# Altium project Core.PrjPcb
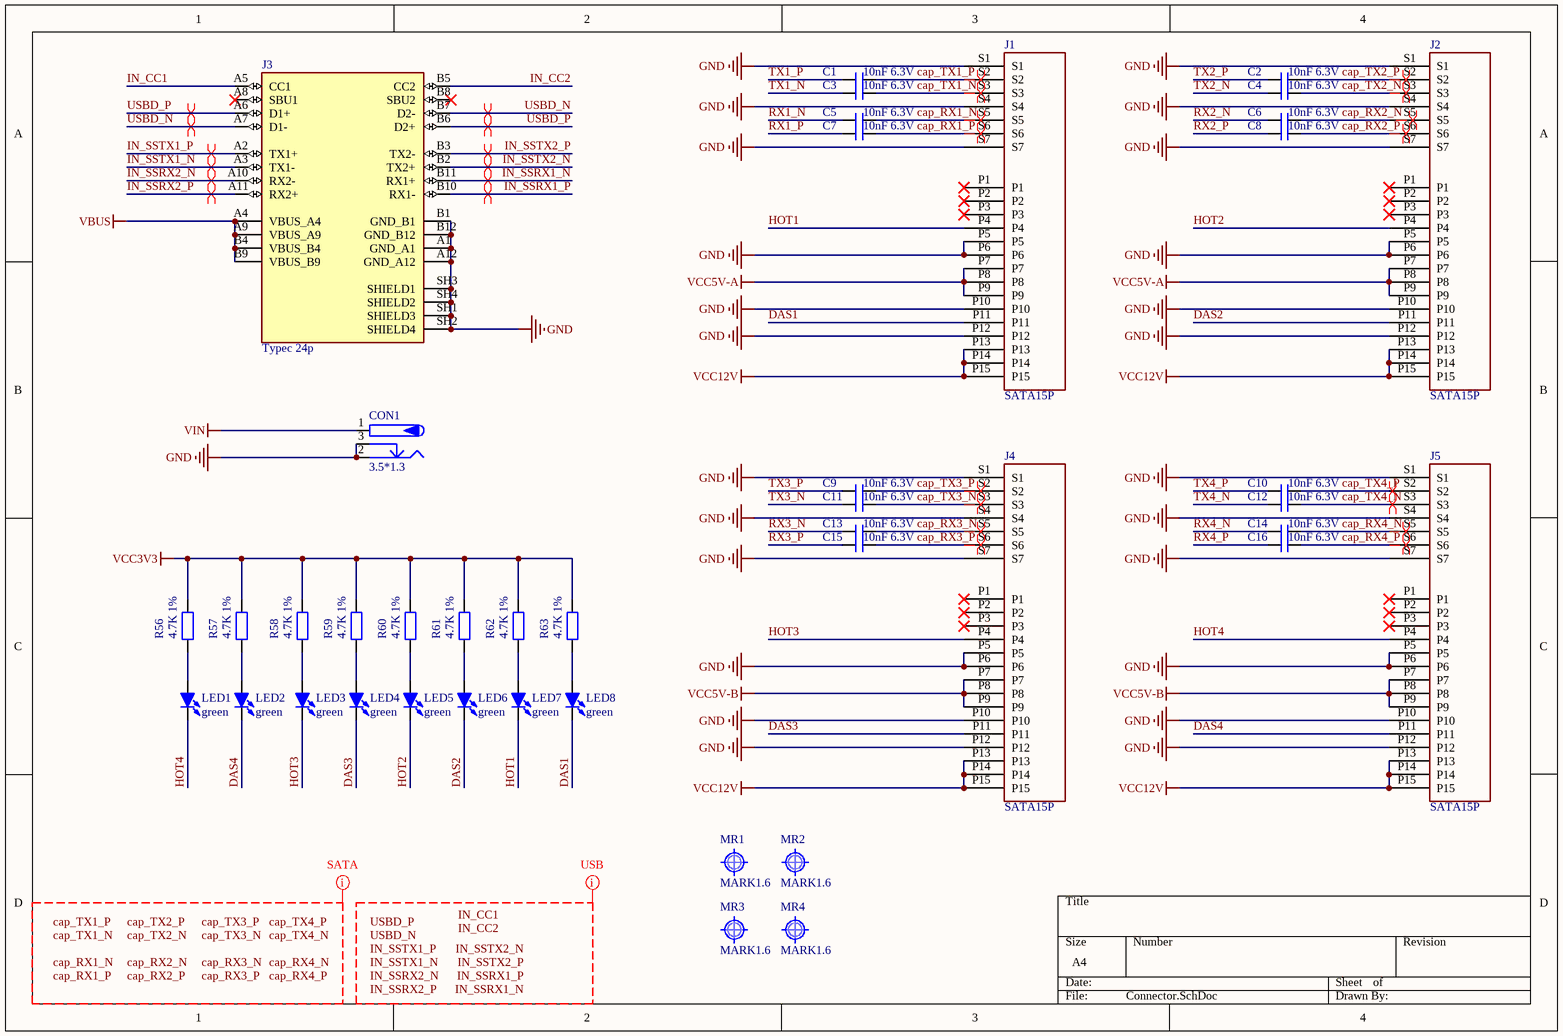
[diagram p0: Connector.SchDoc]
4 sheets, 290 parts. Net scope: global (net labels, ports and power ports of the same name join across sheets).
Board files: PCB1.PcbDoc, Core.PcbDoc
Sheets:
  Connector.SchDoc
  jms578.SchDoc
  Pwr.SchDoc
  Vl822.SchDoc

## Sheet Connector.SchDoc
size A4; SheetNumber: 1; SheetTotal: 4

### Parts
C1  10nF 6.3V  [C0402_L]
C2  10nF 6.3V  [C0402_L]
C3  10nF 6.3V  [C0402_L]
C4  10nF 6.3V  [C0402_L]
C5  10nF 6.3V  [C0402_L]
C6  10nF 6.3V  [C0402_L]
C7  10nF 6.3V  [C0402_L]
C8  10nF 6.3V  [C0402_L]
C9  10nF 6.3V  [C0402_L]
C10  10nF 6.3V  [C0402_L]
C11  10nF 6.3V  [C0402_L]
C12  10nF 6.3V  [C0402_L]
C13  10nF 6.3V  [C0402_L]
C14  10nF 6.3V  [C0402_L]
C15  10nF 6.3V  [C0402_L]
C16  10nF 6.3V  [C0402_L]
CON1  3.5*1.3  [DC-012]
J1  SATA15P  [SATA 15P 贴片]
J2  SATA15P  [SATA 15P 贴片]
J3  Typec 24p  [TypeC 24p 直立]
J4  SATA15P  [SATA 15P 贴片]
J5  SATA15P  [SATA 15P 贴片]
LED1  green  [LED 0805G]
LED2  green  [LED0805_W]
LED3  green  [LED 0805G]
LED4  green  [LED0805_W]
LED5  green  [LED 0805G]
LED6  green  [LED0805_W]
LED7  green  [LED 0805G]
LED8  green  [LED0805_W]
MR1  MARK1.6  [Mark 1]
MR2  MARK1.6  [Mark 1]
MR3  MARK1.6  [Mark 1]
MR4  MARK1.6  [Mark 1]
R56  4.7K 1%  [R0402_L]
R57  4.7K 1%  [R0402_L]
R58  4.7K 1%  [R0402_L]
R59  4.7K 1%  [R0402_L]
R60  4.7K 1%  [R0402_L]
R61  4.7K 1%  [R0402_L]
R62  4.7K 1%  [R0402_L]
R63  4.7K 1%  [R0402_L]

### Nets
GND: CON1.2 CON1.3 J1.P5 J1.P6 J1.P10 J1.P12 J1.S1 J1.S4 J1.S7 J2.P5 J2.P6 J2.P10 J2.P12 J2.S1 J2.S4 J2.S7 J3.A1(GND_A1) J3.A12(GND_A12) J3.B1(GND_B1) J3.B12(GND_B12) J3.SH1(SHIELD3) J3.SH2(SHIELD4) J3.SH3(SHIELD1) J3.SH4(SHIELD2) J4.P5 J4.P6 J4.P10 J4.P12 J4.S1 J4.S4 J4.S7 J5.P5 J5.P6 J5.P10 J5.P12 J5.S1 J5.S4 J5.S7
VBUS: J3.A4(VBUS_A4) J3.A9(VBUS_A9) J3.B4(VBUS_B4) J3.B9(VBUS_B9)
VCC3V3: R56.1 R57.1 R58.1 R59.1 R60.1 R61.1 R62.1 R63.1
VCC5V-A: J1.P7 J1.P8 J1.P9 J2.P7 J2.P8 J2.P9
VCC5V-B: J4.P7 J4.P8 J4.P9 J5.P7 J5.P8 J5.P9
VCC12V: J1.P13 J1.P14 J1.P15 J2.P13 J2.P14 J2.P15 J4.P13 J4.P14 J4.P15 J5.P13 J5.P14 J5.P15
VIN: CON1.1
cap_RX1_N: C5.1 J1.S5
cap_RX1_P: C7.1 J1.S6
cap_RX2_N: C6.1 J2.S5
cap_RX2_P: C8.1 J2.S6
cap_RX3_N: C13.1 J4.S5
cap_RX3_P: C15.1 J4.S6
cap_RX4_N: C14.1 J5.S5
cap_RX4_P: C16.1 J5.S6
cap_TX1_N: C3.1 J1.S3
cap_TX1_P: C1.1 J1.S2
cap_TX2_N: C4.1 J2.S3
cap_TX2_P: C2.1 J2.S2
cap_TX3_N: C11.1 J4.S3
cap_TX3_P: C9.1 J4.S2
cap_TX4_N: C12.1 J5.S3
cap_TX4_P: C10.1 J5.S2
DAS1: J1.P11 LED8.2(K)
DAS2: J2.P11 LED6.2(K)
DAS3: J4.P11 LED4.2(K)
DAS4: J5.P11 LED2.2(K)
HOT1: J1.P4 LED7.2(K)
HOT2: J2.P4 LED5.2(K)
HOT3: J4.P4 LED3.2(K)
HOT4: J5.P4 LED1.2(K)
IN_CC1: J3.A5(CC1)
IN_CC2: J3.B5(CC2)
IN_SSRX1_N: J3.B11(RX1+)
IN_SSRX1_P: J3.B10(RX1-)
IN_SSRX2_N: J3.A10(RX2-)
IN_SSRX2_P: J3.A11(RX2+)
IN_SSTX1_N: J3.A3(TX1-)
IN_SSTX1_P: J3.A2(TX1+)
IN_SSTX2_N: J3.B2(TX2+)
IN_SSTX2_P: J3.B3(TX2-)
RX1_N: C5.2
RX1_P: C7.2
RX2_N: C6.2
RX2_P: C8.2
RX3_N: C13.2
RX3_P: C15.2
RX4_N: C14.2
RX4_P: C16.2
TX1_N: C3.2
TX1_P: C1.2
TX2_N: C4.2
TX2_P: C2.2
TX3_N: C11.2
TX3_P: C9.2
TX4_N: C12.2
TX4_P: C10.2
USBD_N: J3.A7(D1-) J3.B7(D2-)
USBD_P: J3.A6(D1+) J3.B6(D2+)
NetLED1_1: LED1.1(A) R56.2
NetLED2_1: LED2.1(A) R57.2
NetLED3_1: LED3.1(A) R58.2
NetLED4_1: LED4.1(A) R59.2
NetLED5_1: LED5.1(A) R60.2
NetLED6_1: LED6.1(A) R61.2
NetLED7_1: LED7.1(A) R62.2
NetLED8_1: LED8.1(A) R63.2

Not connected (* = marked no-connect by the designer): J1 P1* P2* P3*; J2 P1* P2* P3*; J3 A8(SBU1)* B8(SBU2)*; J4 P1* P2* P3*; J5 P1* P2* P3*

### Layout directives
net class SATA; rule Differential Pairs Routing [Pref Gap = 6mil    Min Gap  = 6mil    Max Gap  = 6milPref Width = 4.29mil    Min Width  = 4.29mil    Max Width  = 4.29mil]: cap_RX1_N, cap_RX1_P, cap_RX2_N, cap_RX2_P, cap_RX3_N, cap_RX3_P, cap_RX4_N, cap_RX4_P, cap_TX1_N, cap_TX1_P, cap_TX2_N, cap_TX2_P, cap_TX3_N, cap_TX3_P, cap_TX4_N, cap_TX4_P
differential pair: (no net found under the mark), cap_RX1_N, cap_RX1_P, cap_RX2_P, cap_RX3_N, cap_RX3_P, cap_RX4_N, cap_RX4_P, cap_TX1_N, cap_TX1_P, cap_TX2_N, cap_TX2_P, cap_TX3_N, cap_TX3_P, cap_TX4_N, cap_TX4_P, IN_SSRX1_N, IN_SSRX1_P, IN_SSRX2_N, IN_SSRX2_P, IN_SSTX1_N, IN_SSTX1_P, IN_SSTX2_N, IN_SSTX2_P, USBD_N, USBD_P
net class USB; rule Differential Pairs Routing [Pref Gap = 4mil    Min Gap  = 4mil    Max Gap  = 4milPref Width = 5.15mil    Min Width  = 5.15mil    Max Width  = 5.15mil]: IN_CC1, IN_CC2, IN_SSRX1_N, IN_SSRX1_P, IN_SSRX2_N, IN_SSRX2_P, IN_SSTX1_N, IN_SSTX1_P, IN_SSTX2_N, IN_SSTX2_P, USBD_N, USBD_P

### Notes on the sheet
- Labels drawn without touching a wire or pin: cap_RX1_N, cap_RX1_P, cap_RX2_N, cap_RX2_P, cap_RX3_N, cap_RX3_P, cap_RX4_N, cap_RX4_P, cap_TX1_N, cap_TX1_P, cap_TX2_N, cap_TX2_P, cap_TX3_N, cap_TX3_P, cap_TX4_N, cap_TX4_P, IN_CC1, IN_CC2, IN_SSRX1_N, IN_SSRX1_P, IN_SSRX2_N, IN_SSRX2_P, IN_SSTX1_N, IN_SSTX1_P, IN_SSTX2_N, IN_SSTX2_P, USBD_N, USBD_P

### Library data of the parts
C1-C16 = C: 无极性贴片电容; 版权归属: 源创客; 材质: X7R; BOM名称: 无极性贴片电容; 学习资源: www.ooocke.com
CON1 = P-DC: 低压电源接口; BOM名称: DC电源接口; 版权归属: 源创客; 学习资源: www.ooocke.com
J3 = Typec 24p: USB-C (USB TYPE-C) USB 3.2 Gen 2 (USB 3.1 Gen 2, Superspeed + (USB 3.1)) Receptacle Connector 24 Position Surface Mount, Right Angle; Through Hole; MF: Molex; MP: 1054500101; SnapEDA_Link: https://www.snapeda.com/parts/1054500101/Molex/view-part/?ref=snap; Package: None; Value: *; Check_prices: https://www.snapeda.com/parts/1054500101/Molex/view-part/?ref=eda
LED1-LED8 = LED-3MM: 插件LED; 版权归属: 源创客; BOM名称: 插件LED; 学习资源: www.ooocke.com
MR1-MR4 = MARK: 光学定位点; 版权归属: 源创客; BOM名称: 光学定位点; 学习资源: www.ooocke.com
R56-R63 = R: 贴片电阻; 版权归属: 源创客; BOM名称: 贴片电阻; 学习资源: www.ooocke.com

## Sheet jms578.SchDoc
size A2; SheetNumber: 2; SheetTotal: 4
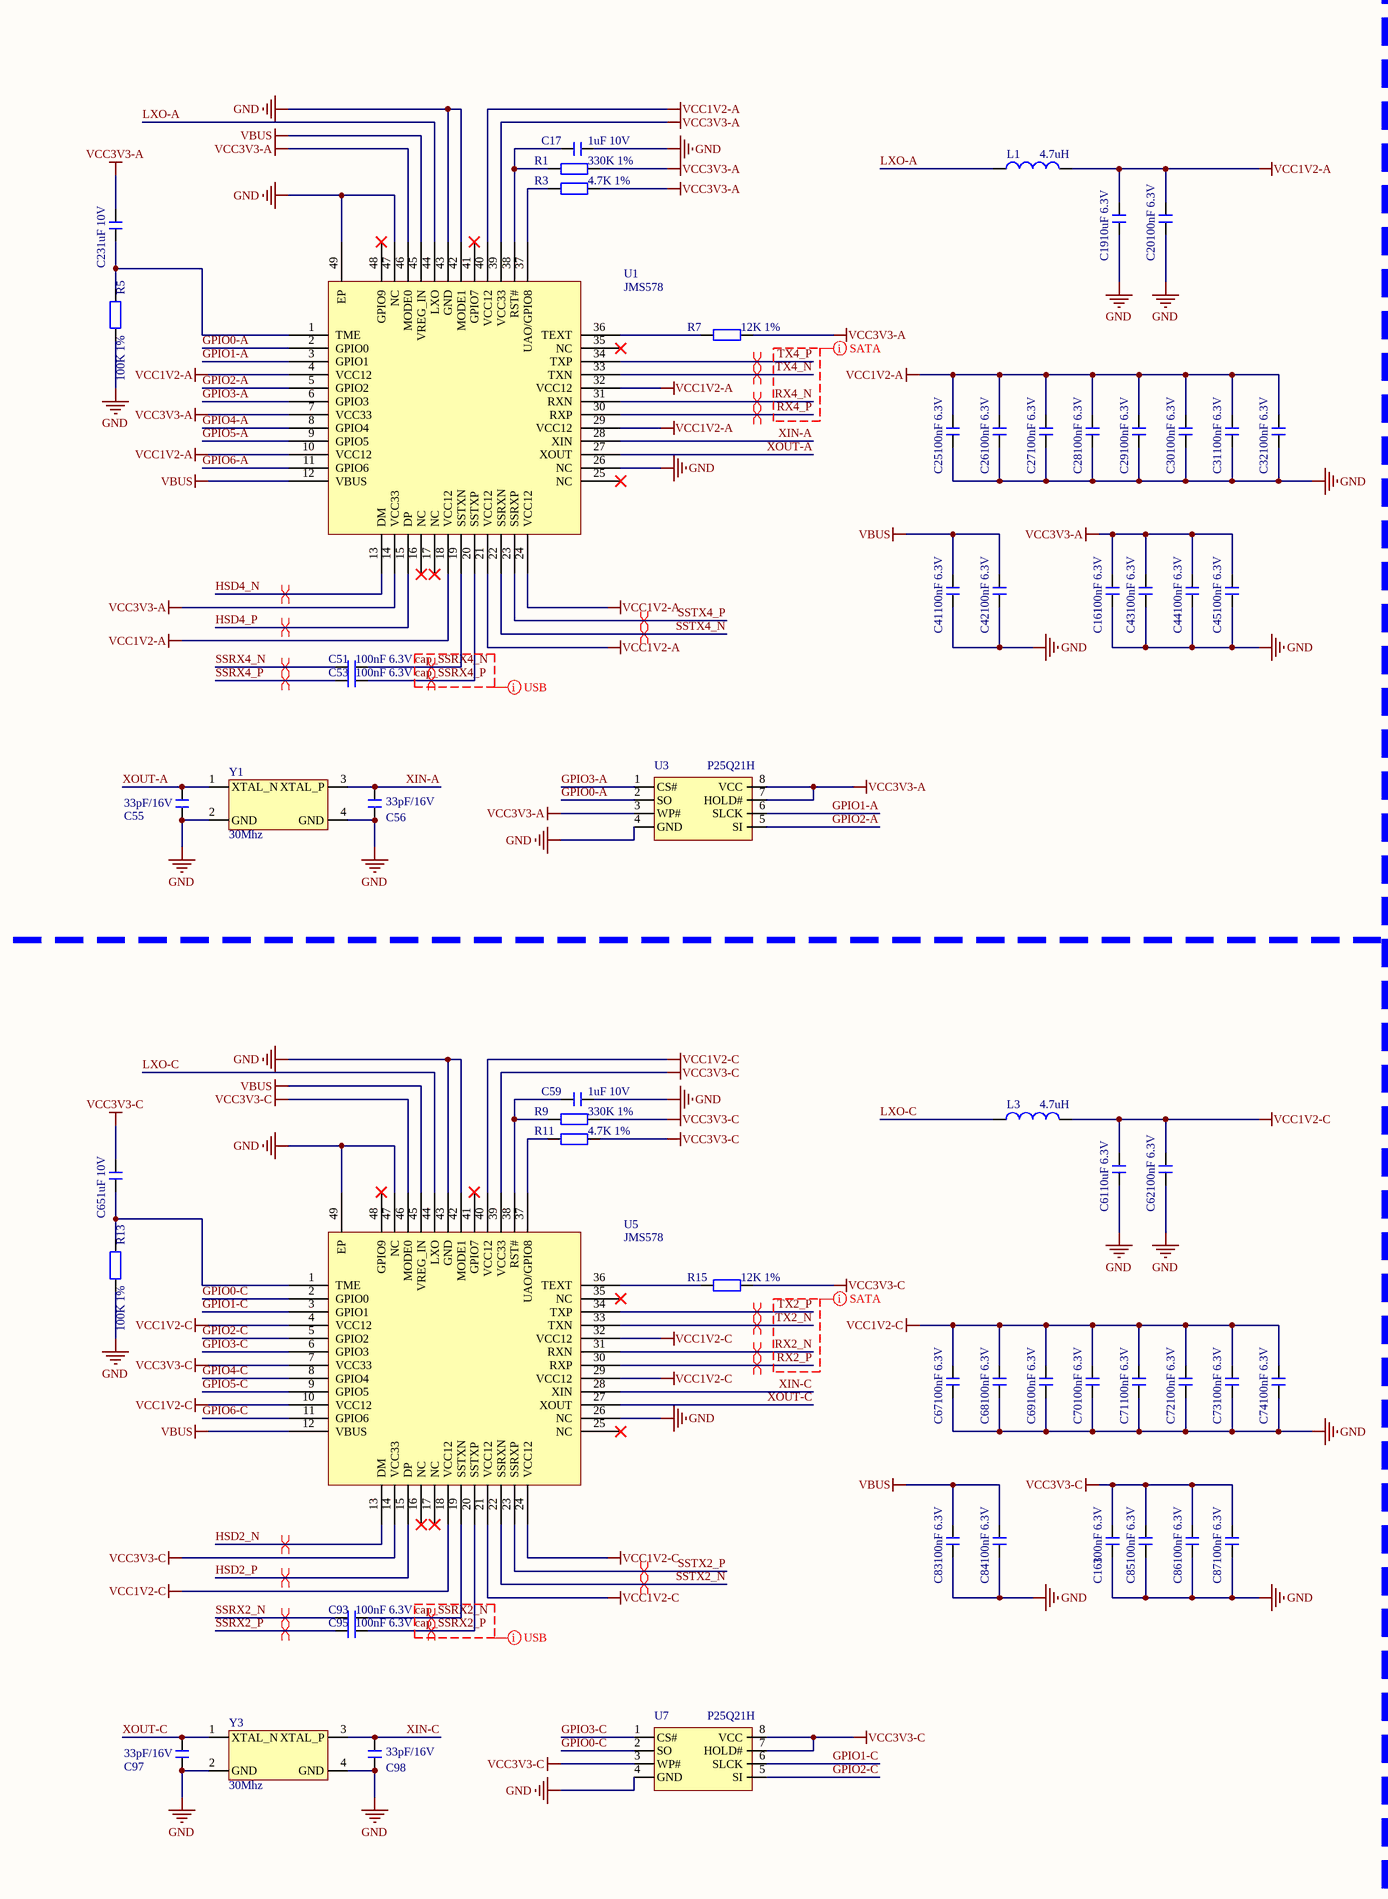
[diagram p1: jms578.SchDoc, left]
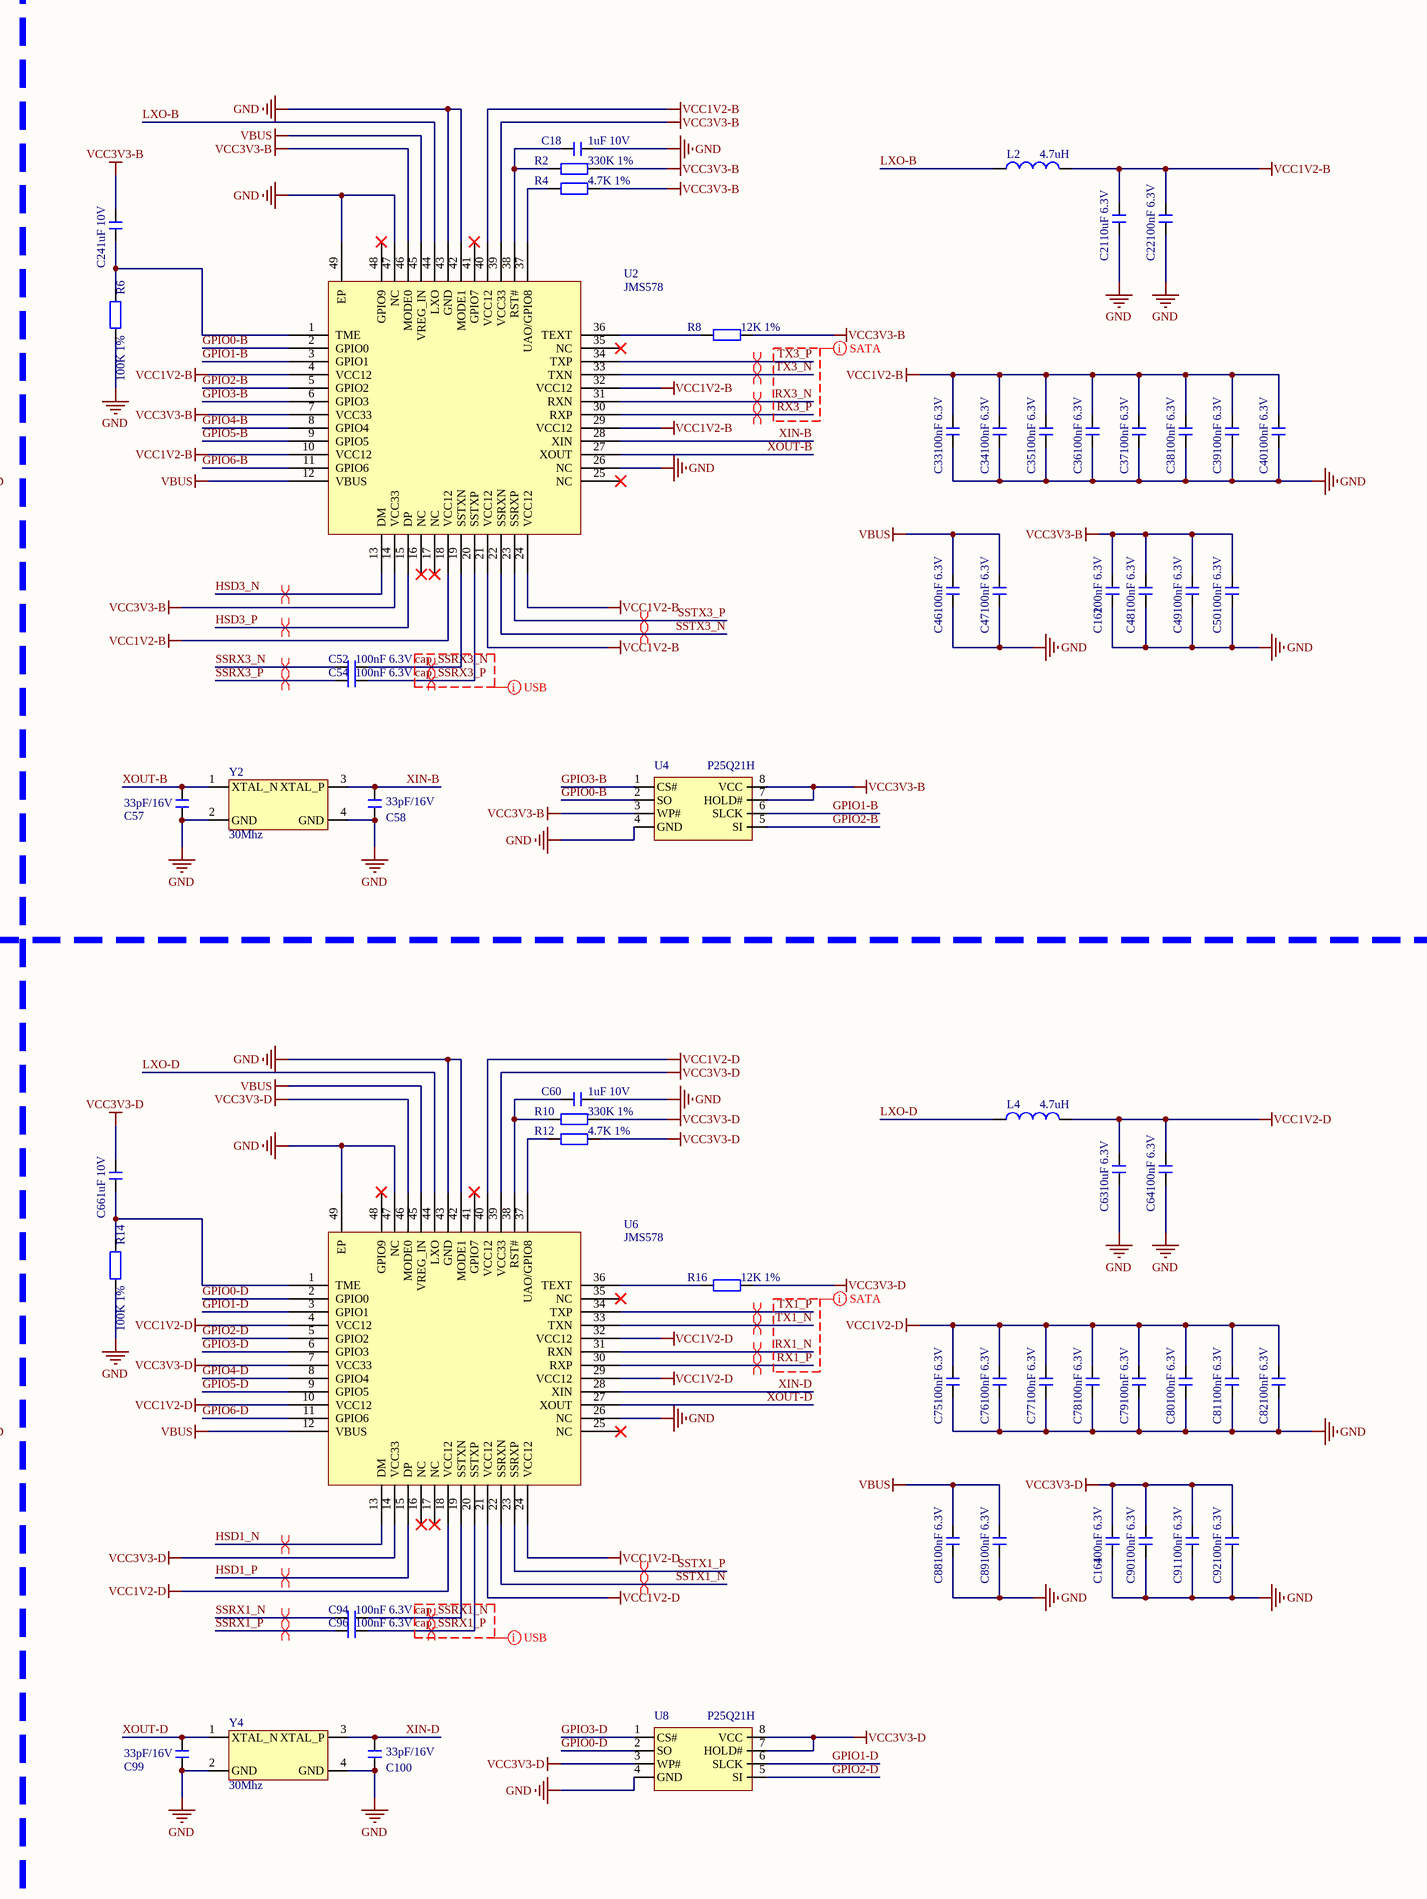
[diagram p2: jms578.SchDoc, right]

### Parts
C17  1uF 10V  [C0402_L]
C18  1uF 10V  [C0402_L]
C19  10uF 6.3V  [C0603_L]
C20  100nF 6.3V  [C0402_L]
C21  10uF 6.3V  [C0603_L]
C22  100nF 6.3V  [C0402_L]
C23  1uF 10V  [C0402_L]
C24  1uF 10V  [C0402_L]
C25  100nF 6.3V  [C0402_L]
C26  100nF 6.3V  [C0402_L]
C27  100nF 6.3V  [C0402_L]
C28  100nF 6.3V  [C0402_L]
C29  100nF 6.3V  [C0402_L]
C30  100nF 6.3V  [C0402_L]
C31  100nF 6.3V  [C0402_L]
C32  100nF 6.3V  [C0402_L]
C33  100nF 6.3V  [C0402_L]
C34  100nF 6.3V  [C0402_L]
C35  100nF 6.3V  [C0402_L]
C36  100nF 6.3V  [C0402_L]
C37  100nF 6.3V  [C0402_L]
C38  100nF 6.3V  [C0402_L]
C39  100nF 6.3V  [C0402_L]
C40  100nF 6.3V  [C0402_L]
C41  100nF 6.3V  [C0402_L]
C42  100nF 6.3V  [C0402_L]
C43  100nF 6.3V  [C0402_L]
C44  100nF 6.3V  [C0402_L]
C45  100nF 6.3V  [C0402_L]
C46  100nF 6.3V  [C0402_L]
C47  100nF 6.3V  [C0402_L]
C48  100nF 6.3V  [C0402_L]
C49  100nF 6.3V  [C0402_L]
C50  100nF 6.3V  [C0402_L]
C51  100nF 6.3V  [C0402_L]
C52  100nF 6.3V  [C0402_L]
C53  100nF 6.3V  [C0402_L]
C54  100nF 6.3V  [C0402_L]
C55  33pF/16V  [C0402_L]
C56  33pF/16V  [C0402_L]
C57  33pF/16V  [C0402_L]
C58  33pF/16V  [C0402_L]
C59  1uF 10V  [C0402_L]
C60  1uF 10V  [C0402_L]
C61  10uF 6.3V  [C0603_L]
C62  100nF 6.3V  [C0402_L]
C63  10uF 6.3V  [C0603_L]
C64  100nF 6.3V  [C0402_L]
C65  1uF 10V  [C0402_L]
C66  1uF 10V  [C0402_L]
C67  100nF 6.3V  [C0402_L]
C68  100nF 6.3V  [C0402_L]
C69  100nF 6.3V  [C0402_L]
C70  100nF 6.3V  [C0402_L]
C71  100nF 6.3V  [C0402_L]
C72  100nF 6.3V  [C0402_L]
C73  100nF 6.3V  [C0402_L]
C74  100nF 6.3V  [C0402_L]
C75  100nF 6.3V  [C0402_L]
C76  100nF 6.3V  [C0402_L]
C77  100nF 6.3V  [C0402_L]
C78  100nF 6.3V  [C0402_L]
C79  100nF 6.3V  [C0402_L]
C80  100nF 6.3V  [C0402_L]
C81  100nF 6.3V  [C0402_L]
C82  100nF 6.3V  [C0402_L]
C83  100nF 6.3V  [C0402_L]
C84  100nF 6.3V  [C0402_L]
C85  100nF 6.3V  [C0402_L]
C86  100nF 6.3V  [C0402_L]
C87  100nF 6.3V  [C0402_L]
C88  100nF 6.3V  [C0402_L]
C89  100nF 6.3V  [C0402_L]
C90  100nF 6.3V  [C0402_L]
C91  100nF 6.3V  [C0402_L]
C92  100nF 6.3V  [C0402_L]
C93  100nF 6.3V  [C0402_L]
C94  100nF 6.3V  [C0402_L]
C95  100nF 6.3V  [C0402_L]
C96  100nF 6.3V  [C0402_L]
C97  33pF/16V  [C0402_L]
C98  33pF/16V  [C0402_L]
C99  33pF/16V  [C0402_L]
C100  33pF/16V  [C0402_L]
C161  100nF 6.3V  [C0402_L]
C162  100nF 6.3V  [C0402_L]
C163  100nF 6.3V  [C0402_L]
C164  100nF 6.3V  [C0402_L]
L1  4.7uH  [NR2520]
L2  4.7uH  [NR2520]
L3  4.7uH  [NR2520]
L4  4.7uH  [NR2520]
R1  330K 1%  [R0402_L]
R2  330K 1%  [R0402_L]
R3  4.7K 1%  [R0402_L]
R4  4.7K 1%  [R0402_L]
R5  100K 1%  [R0402_L]
R6  100K 1%  [R0402_L]
R7  12K 1%  [R0402_L]
R8  12K 1%  [R0402_L]
R9  330K 1%  [R0402_L]
R10  330K 1%  [R0402_L]
R11  4.7K 1%  [R0402_L]
R12  4.7K 1%  [R0402_L]
R13  100K 1%  [R0402_L]
R14  100K 1%  [R0402_L]
R15  12K 1%  [R0402_L]
R16  12K 1%  [R0402_L]
U1  JMS578  [QFN48-L6.0-W6.0-P0.4]
U2  JMS578  [QFN48-L6.0-W6.0-P0.4]
U3  P25Q21H  [SOP8_L]
U4  P25Q21H  [SOP8_L]
U5  JMS578  [QFN48-L6.0-W6.0-P0.4]
U6  JMS578  [QFN48-L6.0-W6.0-P0.4]
U7  P25Q21H  [SOP8_L]
U8  P25Q21H  [SOP8_L]
Y1  30Mhz  [OSC 3225-4P]
Y2  30Mhz  [OSC 3225-4P]
Y3  30Mhz  [OSC 3225-4P]
Y4  30Mhz  [OSC 3225-4P]

### Nets
GND: C17.1 C18.1 C19.1 C20.1 C21.1 C22.1 C25.1 C26.1 C27.1 C28.1 C29.1 C30.1 C31.1 C32.1 C33.1 C34.1 C35.1 C36.1 C37.1 C38.1 C39.1 C40.1 C41.1 C42.1 C43.1 C44.1 C45.1 C46.1 C47.1 C48.1 C49.1 C50.1 C55.2 C56.2 C57.2 C58.2 C59.1 C60.1 C61.1 C62.1 C63.1 C64.1 C67.1 C68.1 C69.1 C70.1 C71.1 C72.1 C73.1 C74.1 C75.1 C76.1 C77.1 C78.1 C79.1 C80.1 C81.1 C82.1 C83.1 C84.1 C85.1 C86.1 C87.1 C88.1 C89.1 C90.1 C91.1 C92.1 C97.2 C98.2 C99.2 C100.2 C161.1 C162.1 C163.1 C164.1 R5.1 R6.1 R13.1 R14.1 U1.26(NC) U1.42(MODE1) U1.43(GND) U1.47(NC) U1.49(EP) U2.26(NC) U2.42(MODE1) U2.43(GND) U2.47(NC) U2.49(EP) U3.4(GND) U4.4(GND) U5.26(NC) U5.42(MODE1) U5.43(GND) U5.47(NC) U5.49(EP) U6.26(NC) U6.42(MODE1) U6.43(GND) U6.47(NC) U6.49(EP) U7.4(GND) U8.4(GND) Y1.2(GND) Y1.4(GND) Y2.2(GND) Y2.4(GND) Y3.2(GND) Y3.4(GND) Y4.2(GND) Y4.4(GND)
VBUS: C41.2 C42.2 C46.2 C47.2 C83.2 C84.2 C88.2 C89.2 U1.12(VBUS) U1.45(VREG_IN) U2.12(VBUS) U2.45(VREG_IN) U5.12(VBUS) U5.45(VREG_IN) U6.12(VBUS) U6.45(VREG_IN)
VCC1V2-A: C19.2 C20.2 C25.2 C26.2 C27.2 C28.2 C29.2 C30.2 C31.2 C32.2 L1.2 U1.4(VCC12) U1.10(VCC12) U1.18(VCC12) U1.21(VCC12) U1.24(VCC12) U1.29(VCC12) U1.32(VCC12) U1.40(VCC12)
VCC1V2-B: C21.2 C22.2 C33.2 C34.2 C35.2 C36.2 C37.2 C38.2 C39.2 C40.2 L2.2 U2.4(VCC12) U2.10(VCC12) U2.18(VCC12) U2.21(VCC12) U2.24(VCC12) U2.29(VCC12) U2.32(VCC12) U2.40(VCC12)
VCC1V2-C: C61.2 C62.2 C67.2 C68.2 C69.2 C70.2 C71.2 C72.2 C73.2 C74.2 L3.2 U5.4(VCC12) U5.10(VCC12) U5.18(VCC12) U5.21(VCC12) U5.24(VCC12) U5.29(VCC12) U5.32(VCC12) U5.40(VCC12)
VCC1V2-D: C63.2 C64.2 C75.2 C76.2 C77.2 C78.2 C79.2 C80.2 C81.2 C82.2 L4.2 U6.4(VCC12) U6.10(VCC12) U6.18(VCC12) U6.21(VCC12) U6.24(VCC12) U6.29(VCC12) U6.32(VCC12) U6.40(VCC12)
VCC3V3-A: C23.2 C43.2 C44.2 C45.2 C161.2 R1.1 R3.1 R7.1 U1.7(VCC33) U1.14(VCC33) U1.39(VCC33) U1.46(MODE0) U3.3(WP#) U3.7(HOLD#) U3.8(VCC)
VCC3V3-B: C24.2 C48.2 C49.2 C50.2 C162.2 R2.1 R4.1 R8.1 U2.7(VCC33) U2.14(VCC33) U2.39(VCC33) U2.46(MODE0) U4.3(WP#) U4.7(HOLD#) U4.8(VCC)
VCC3V3-C: C65.2 C85.2 C86.2 C87.2 C163.2 R9.1 R11.1 R15.1 U5.7(VCC33) U5.14(VCC33) U5.39(VCC33) U5.46(MODE0) U7.3(WP#) U7.7(HOLD#) U7.8(VCC)
VCC3V3-D: C66.2 C90.2 C91.2 C92.2 C164.2 R10.1 R12.1 R16.1 U6.7(VCC33) U6.14(VCC33) U6.39(VCC33) U6.46(MODE0) U8.3(WP#) U8.7(HOLD#) U8.8(VCC)
cap_SSRX1_N: C94.2 U6.19(SSTXN)
cap_SSRX1_P: C96.2 U6.20(SSTXP)
cap_SSRX2_N: C93.2 U5.19(SSTXN)
cap_SSRX2_P: C95.2 U5.20(SSTXP)
cap_SSRX3_N: C52.2 U2.19(SSTXN)
cap_SSRX3_P: C54.2 U2.20(SSTXP)
cap_SSRX4_N: C51.2 U1.19(SSTXN)
cap_SSRX4_P: C53.2 U1.20(SSTXP)
GPIO0-A: U1.2(GPIO0) U3.2(SO)
GPIO0-B: U2.2(GPIO0) U4.2(SO)
GPIO0-C: U5.2(GPIO0) U7.2(SO)
GPIO0-D: U6.2(GPIO0) U8.2(SO)
GPIO1-A: U1.3(GPIO1) U3.6(SLCK)
GPIO1-B: U2.3(GPIO1) U4.6(SLCK)
GPIO1-C: U5.3(GPIO1) U7.6(SLCK)
GPIO1-D: U6.3(GPIO1) U8.6(SLCK)
GPIO2-A: U1.5(GPIO2) U3.5(SI)
GPIO2-B: U2.5(GPIO2) U4.5(SI)
GPIO2-C: U5.5(GPIO2) U7.5(SI)
GPIO2-D: U6.5(GPIO2) U8.5(SI)
GPIO3-A: U1.6(GPIO3) U3.1(CS#)
GPIO3-B: U2.6(GPIO3) U4.1(CS#)
GPIO3-C: U5.6(GPIO3) U7.1(CS#)
GPIO3-D: U6.6(GPIO3) U8.1(CS#)
GPIO4-A: U1.8(GPIO4)
GPIO4-B: U2.8(GPIO4)
GPIO4-C: U5.8(GPIO4)
GPIO4-D: U6.8(GPIO4)
GPIO5-A: U1.9(GPIO5)
GPIO5-B: U2.9(GPIO5)
GPIO5-C: U5.9(GPIO5)
GPIO5-D: U6.9(GPIO5)
GPIO6-A: U1.11(GPIO6)
GPIO6-B: U2.11(GPIO6)
GPIO6-C: U5.11(GPIO6)
GPIO6-D: U6.11(GPIO6)
HSD1_N: U6.13(DM)
HSD1_P: U6.15(DP)
HSD2_N: U5.13(DM)
HSD2_P: U5.15(DP)
HSD3_N: U2.13(DM)
HSD3_P: U2.15(DP)
HSD4_N: U1.13(DM)
HSD4_P: U1.15(DP)
LXO-A: L1.1 U1.44(LXO)
LXO-B: L2.1 U2.44(LXO)
LXO-C: L3.1 U5.44(LXO)
LXO-D: L4.1 U6.44(LXO)
RX1_N: U6.31(RXN)
RX1_P: U6.30(RXP)
RX2_N: U5.31(RXN)
RX2_P: U5.30(RXP)
RX3_N: U2.31(RXN)
RX3_P: U2.30(RXP)
RX4_N: U1.31(RXN)
RX4_P: U1.30(RXP)
SSRX1_N: C94.1
SSRX1_P: C96.1
SSRX2_N: C93.1
SSRX2_P: C95.1
SSRX3_N: C52.1
SSRX3_P: C54.1
SSRX4_N: C51.1
SSRX4_P: C53.1
SSTX1_N: U6.22(SSRXN)
SSTX1_P: U6.23(SSRXP)
SSTX2_N: U5.22(SSRXN)
SSTX2_P: U5.23(SSRXP)
SSTX3_N: U2.22(SSRXN)
SSTX3_P: U2.23(SSRXP)
SSTX4_N: U1.22(SSRXN)
SSTX4_P: U1.23(SSRXP)
TX1_N: U6.33(TXN)
TX1_P: U6.34(TXP)
TX2_N: U5.33(TXN)
TX2_P: U5.34(TXP)
TX3_N: U2.33(TXN)
TX3_P: U2.34(TXP)
TX4_N: U1.33(TXN)
TX4_P: U1.34(TXP)
XIN-A: C56.1 U1.28(XIN) Y1.3(XTAL_P)
XIN-B: C58.1 U2.28(XIN) Y2.3(XTAL_P)
XIN-C: C98.1 U5.28(XIN) Y3.3(XTAL_P)
XIN-D: C100.1 U6.28(XIN) Y4.3(XTAL_P)
XOUT-A: C55.1 U1.27(XOUT) Y1.1(XTAL_N)
XOUT-B: C57.1 U2.27(XOUT) Y2.1(XTAL_N)
XOUT-C: C97.1 U5.27(XOUT) Y3.1(XTAL_N)
XOUT-D: C99.1 U6.27(XOUT) Y4.1(XTAL_N)
NetC17_2: C17.2 R1.2 U1.38(RST#)
NetC18_2: C18.2 R2.2 U2.38(RST#)
NetC23_1: C23.1 R5.2 U1.1(TME)
NetC24_1: C24.1 R6.2 U2.1(TME)
NetC59_2: C59.2 R9.2 U5.38(RST#)
NetC60_2: C60.2 R10.2 U6.38(RST#)
NetC65_1: C65.1 R13.2 U5.1(TME)
NetC66_1: C66.1 R14.2 U6.1(TME)
NetR3_2: R3.2 U1.37(UAO/GPIO8)
NetR4_2: R4.2 U2.37(UAO/GPIO8)
NetR7_2: R7.2 U1.36(TEXT)
NetR8_2: R8.2 U2.36(TEXT)
NetR11_2: R11.2 U5.37(UAO/GPIO8)
NetR12_2: R12.2 U6.37(UAO/GPIO8)
NetR15_2: R15.2 U5.36(TEXT)
NetR16_2: R16.2 U6.36(TEXT)

Not connected (* = marked no-connect by the designer): U1 16(NC)* 17(NC)* 25(NC)* 35(NC)* 41(GPIO7)* 48(GPIO9)*; U2 16(NC)* 17(NC)* 25(NC)* 35(NC)* 41(GPIO7)* 48(GPIO9)*; U5 16(NC)* 17(NC)* 25(NC)* 35(NC)* 41(GPIO7)* 48(GPIO9)*; U6 16(NC)* 17(NC)* 25(NC)* 35(NC)* 41(GPIO7)* 48(GPIO9)*

### Layout directives
differential pair: cap_SSRX1_N, cap_SSRX1_P, cap_SSRX2_N, cap_SSRX2_P, cap_SSRX3_N, cap_SSRX3_P, cap_SSRX4_N, cap_SSRX4_P, HSD1_N, HSD1_P, HSD2_N, HSD2_P, HSD3_N, HSD3_P, HSD4_N, HSD4_P, RX1_N, RX1_P, RX2_N, RX2_P, RX3_N, RX3_P, RX4_N, RX4_P, SSRX1_N, SSRX1_P, SSRX2_N, SSRX2_P, SSRX3_N, SSRX3_P, SSRX4_N, SSRX4_P, SSTX1_N, SSTX1_P, SSTX2_N, SSTX2_P, SSTX3_N, SSTX3_P, SSTX4_N, SSTX4_P, TX1_N, TX1_P, TX2_N, TX2_P, TX3_N, TX3_P, TX4_N, TX4_P
net class USB; rule Differential Pairs Routing [Pref Gap = 4mil    Min Gap  = 4mil    Max Gap  = 4milPref Width = 5.15mil    Min Width  = 5.15mil    Max Width  = 5.15mil]: cap_SSRX1_N, cap_SSRX1_P, cap_SSRX2_N, cap_SSRX2_P, cap_SSRX3_N, cap_SSRX3_P, cap_SSRX4_N, cap_SSRX4_P
net class SATA; rule Differential Pairs Routing [Pref Gap = 6mil    Min Gap  = 6mil    Max Gap  = 6milPref Width = 4.29mil    Min Width  = 4.29mil    Max Width  = 4.29mil]: RX1_N, RX1_P, RX2_N, RX2_P, RX3_N, RX3_P, RX4_N, RX4_P, TX1_N, TX1_P, TX2_N, TX2_P, TX3_N, TX3_P, TX4_N, TX4_P

### Library data of the parts
C17-C100 C161-C164 = C: 无极性贴片电容; 版权归属: 源创客; 材质: X7R; BOM名称: 无极性贴片电容; 学习资源: www.ooocke.com
L1-L4 = L: 小功率贴片电感; 版权归属: 源创客; BOM名称: 小功率贴片电感; 学习资源: www.ooocke.com
R1-R16 = R: 贴片电阻; 版权归属: 源创客; BOM名称: 贴片电阻; 学习资源: www.ooocke.com
U3 U4 U7 U8 = P25D40H
Y1-Y4 = Crystal

## Sheet Pwr.SchDoc
size A3; SheetNumber: 3; SheetTotal: 4
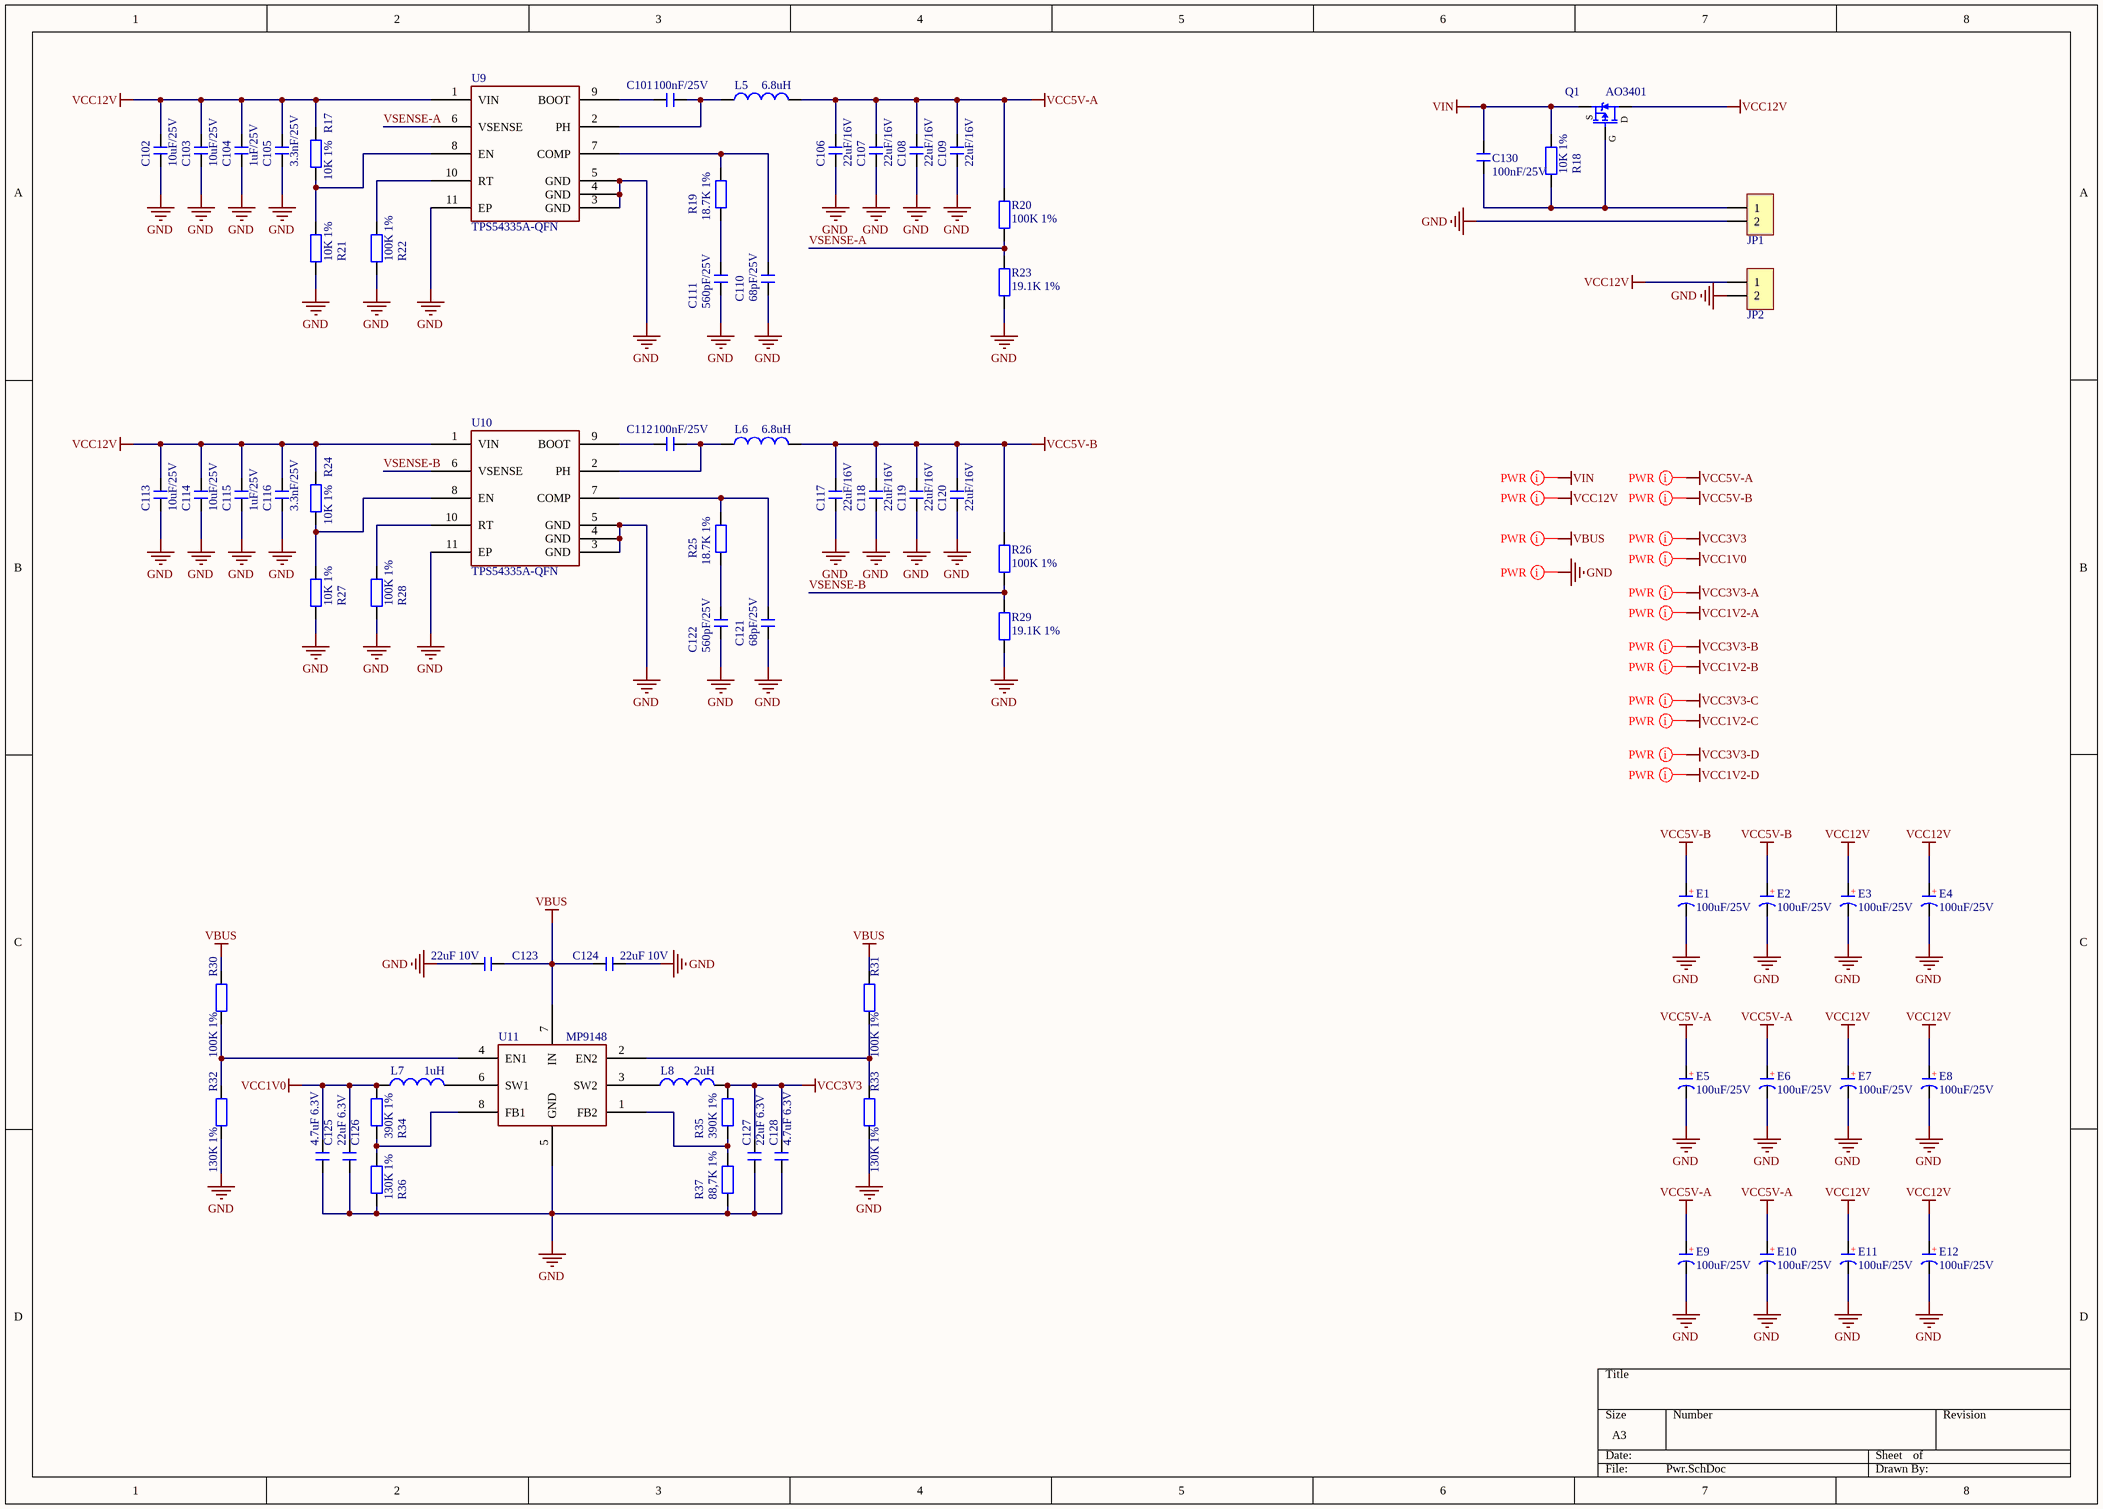
[diagram p3: Pwr.SchDoc]

### Parts
C101  100nF/25V  [C0402_L]
C102  10uF/25V  [C0603_L]
C103  10uF/25V  [C0603_L]
C104  1uF/25V  [C0603_L]
C105  3.3nF/25V  [C0603_L]
C106  22uF/16V  [C0603_L]
C107  22uF/16V  [C0603_L]
C108  22uF/16V  [C0603_L]
C109  22uF/16V  [C0603_L]
C110  68pF/25V  [C0402_L]
C111  560pF/25V  [C0402_L]
C112  100nF/25V  [C0402_L]
C113  10uF/25V  [C0603_L]
C114  10uF/25V  [C0603_L]
C115  1uF/25V  [C0603_L]
C116  3.3nF/25V  [C0603_L]
C117  22uF/16V  [C0603_L]
C118  22uF/16V  [C0603_L]
C119  22uF/16V  [C0603_L]
C120  22uF/16V  [C0603_L]
C121  68pF/25V  [C0402_L]
C122  560pF/25V  [C0402_L]
C123  22uF 10V  [C0603_L]
C124  22uF 10V  [C0603_L]
C125  4.7uF 6.3V  [C0603_L]
C126  22uF 6.3V  [C0603_L]
C127  22uF 6.3V  [C0603_L]
C128  4.7uF 6.3V  [C0603_L]
C130  100nF/25V  [C0402_L]
E1  100uF/25V  [CS 6*4 - B]
E2  100uF/25V  [CS 6*4 - B]
E3  100uF/25V  [CS 6*4 - B]
E4  100uF/25V  [CS 6*4 - B]
E5  100uF/25V  [CS 6*4 - B]
E6  100uF/25V  [CS 6*4 - B]
E7  100uF/25V  [CS 6*4 - B]
E8  100uF/25V  [CS 6*4 - B]
E9  100uF/25V  [CS 6*4 - B]
E10  100uF/25V  [CS 6*4 - B]
E11  100uF/25V  [CS 6*4 - B]
E12  100uF/25V  [CS 6*4 - B]
JP1  HDR-1X2  [ZH1.5-WS-2P]  (value not drawn)
JP2  HDR-1X2  [XH2.54-WS-2P]  (value not drawn)
L5  6.8uH  [NR4020]
L6  6.8uH  [NR4020]
L7  1uH  [NR4020]
L8  2uH  [NR4020]
Q1  AO3401  [DFN8-L3.0-W3.0-P0.65_EP]
R17  10K 1%  [R0402_L]
R18  10K 1%  [R0402_L]
R19  18.7K 1%  [R0402_L]
R20  100K 1%  [R0402_L]
R21  10K 1%  [R0402_L]
R22  100K 1%  [R0402_L]
R23  19.1K 1%  [R0402_L]
R24  10K 1%  [R0402_L]
R25  18.7K 1%  [R0402_L]
R26  100K 1%  [R0402_L]
R27  10K 1%  [R0402_L]
R28  100K 1%  [R0402_L]
R29  19.1K 1%  [R0402_L]
R30  100K 1%  [R0402_L]
R31  100K 1%  [R0402_L]
R32  130K 1%  [R0402_L]
R33  130K 1%  [R0402_L]
R34  390K 1%  [R0402_L]
R35  390K 1%  [R0402_L]
R36  130K 1%  [R0402_L]
R37  88,7K 1%  [R0402_L]
U9  TPS54335A-QFN  [VSON-10_L3.0-W3.0-P0.50-TL-EP]
U10  TPS54335A-QFN  [VSON-10_L3.0-W3.0-P0.50-TL-EP]
U11  MP9148  [SOT23-8]

### Nets
GND: C102.1 C103.1 C104.1 C105.1 C106.1 C107.1 C108.1 C109.1 C110.1 C111.1 C113.1 C114.1 C115.1 C116.1 C117.1 C118.1 C119.1 C120.1 C121.1 C122.1 C123.1 C124.1 C125.1 C126.1 C127.1 C128.1 E1.2(K) E2.2(K) E3.2(K) E4.2(K) E5.2(K) E6.2(K) E7.2(K) E8.2(K) E9.2(K) E10.2(K) E11.2(K) E12.2(K) JP1.2 JP2.2 R21.2 R22.2 R23.2 R27.2 R28.2 R29.2 R32.2 R33.2 R36.2 R37.2 U9.3(GND) U9.4(GND) U9.5(GND) U9.11(EP) U10.3(GND) U10.4(GND) U10.5(GND) U10.11(EP) U11.5(GND)
VBUS: C123.2 C124.2 R30.1 R31.1 U11.7(IN)
VCC1V0: C125.2 C126.2 L7.1 R34.1
VCC3V3: C127.2 C128.2 L8.1 R35.1
VCC5V-A: C106.2 C107.2 C108.2 C109.2 E5.1(A) E6.1(A) E9.1(A) E10.1(A) L5.2 R20.1
VCC5V-B: C117.2 C118.2 C119.2 C120.2 E1.1(A) E2.1(A) L6.2 R26.1
VCC12V: C102.2 C103.2 C104.2 C105.2 C113.2 C114.2 C115.2 C116.2 E3.1(A) E4.1(A) E7.1(A) E8.1(A) E11.1(A) E12.1(A) JP2.1 Q1.3(D) R17.1 R24.1 U9.1(VIN) U10.1(VIN)
VIN: C130.1 Q1.2(S) R18.1
VSENSE-A: R20.2 R23.1 U9.6(VSENSE)
VSENSE-B: R26.2 R29.1 U10.6(VSENSE)
NetC101_1: C101.1 L5.1 U9.2(PH)
NetC101_2: C101.2 U9.9(BOOT)
NetC110_2: C110.2 R19.1 U9.7(COMP)
NetC111_2: C111.2 R19.2
NetC112_1: C112.1 L6.1 U10.2(PH)
NetC112_2: C112.2 U10.9(BOOT)
NetC121_2: C121.2 R25.1 U10.7(COMP)
NetC122_2: C122.2 R25.2
NetC130_2: C130.2 JP1.1 Q1.1(G) R18.2
NetL7_2: L7.2 U11.6(SW1)
NetL8_2: L8.2 U11.3(SW2)
NetR17_2: R17.2 R21.1 U9.8(EN)
NetR22_1: R22.1 U9.10(RT)
NetR24_2: R24.2 R27.1 U10.8(EN)
NetR28_1: R28.1 U10.10(RT)
NetR30_2: R30.2 R32.1 U11.4(EN1)
NetR31_2: R31.2 R33.1 U11.2(EN2)
NetR34_2: R34.2 R36.1 U11.8(FB1)
NetR35_2: R35.2 R37.1 U11.1(FB2)

### Layout directives
net class PWR; rule Width Constraint [Pref Width = 8mil    Min Width = 6mil    Max Width = 50mil]: GND, VBUS, VCC1V0, VCC1V2-A, VCC1V2-B, VCC1V2-C, VCC1V2-D, VCC3V3, VCC3V3-A, VCC3V3-B, VCC3V3-D, VCC5V-A, VCC5V-B, VCC12V, VIN
net class PWR: VCC3V3-C

### Notes on the sheet
- Labels drawn without touching a wire or pin: GND, VBUS, VCC1V0, VCC1V2-A, VCC1V2-B, VCC1V2-C, VCC1V2-D, VCC3V3, VCC3V3-A, VCC3V3-B, VCC3V3-C, VCC3V3-D, VCC5V-A, VCC5V-B, VCC12V, VIN
- (in symbol C-CD) +

### Library data of the parts
C101-C128 C130 = C: 无极性贴片电容; 版权归属: 源创客; 材质: X7R; BOM名称: 无极性贴片电容; 学习资源: www.ooocke.com
E1-E12 = C-CD: 贴片钽电容; 版权归属: 源创客; BOM名称: 贴片钽电容; 学习资源: www.ooocke.com
JP1 JP2 = Header 2: 2P接插件; 版权归属: 源创客; BOM名称: 2P接插件; 学习资源: www.ooocke.com
L5-L8 = L: 小功率贴片电感; 版权归属: 源创客; BOM名称: 小功率贴片电感; 学习资源: www.ooocke.com
Q1 = AO3401: P沟道 30V/4.2A; BOM名称: 场效应管; 版权归属: 源创客; 学习资源: www.ooocke.com; 描述: P沟道 30V/4.2A
R17-R37 = R: 贴片电阻; 版权归属: 源创客; BOM名称: 贴片电阻; 学习资源: www.ooocke.com
U9 U10 = TPS54335A-QFN: BUCK
U11 = MP9148: BUCK

## Sheet Vl822.SchDoc
size A3; SheetNumber: 4; SheetTotal: 4
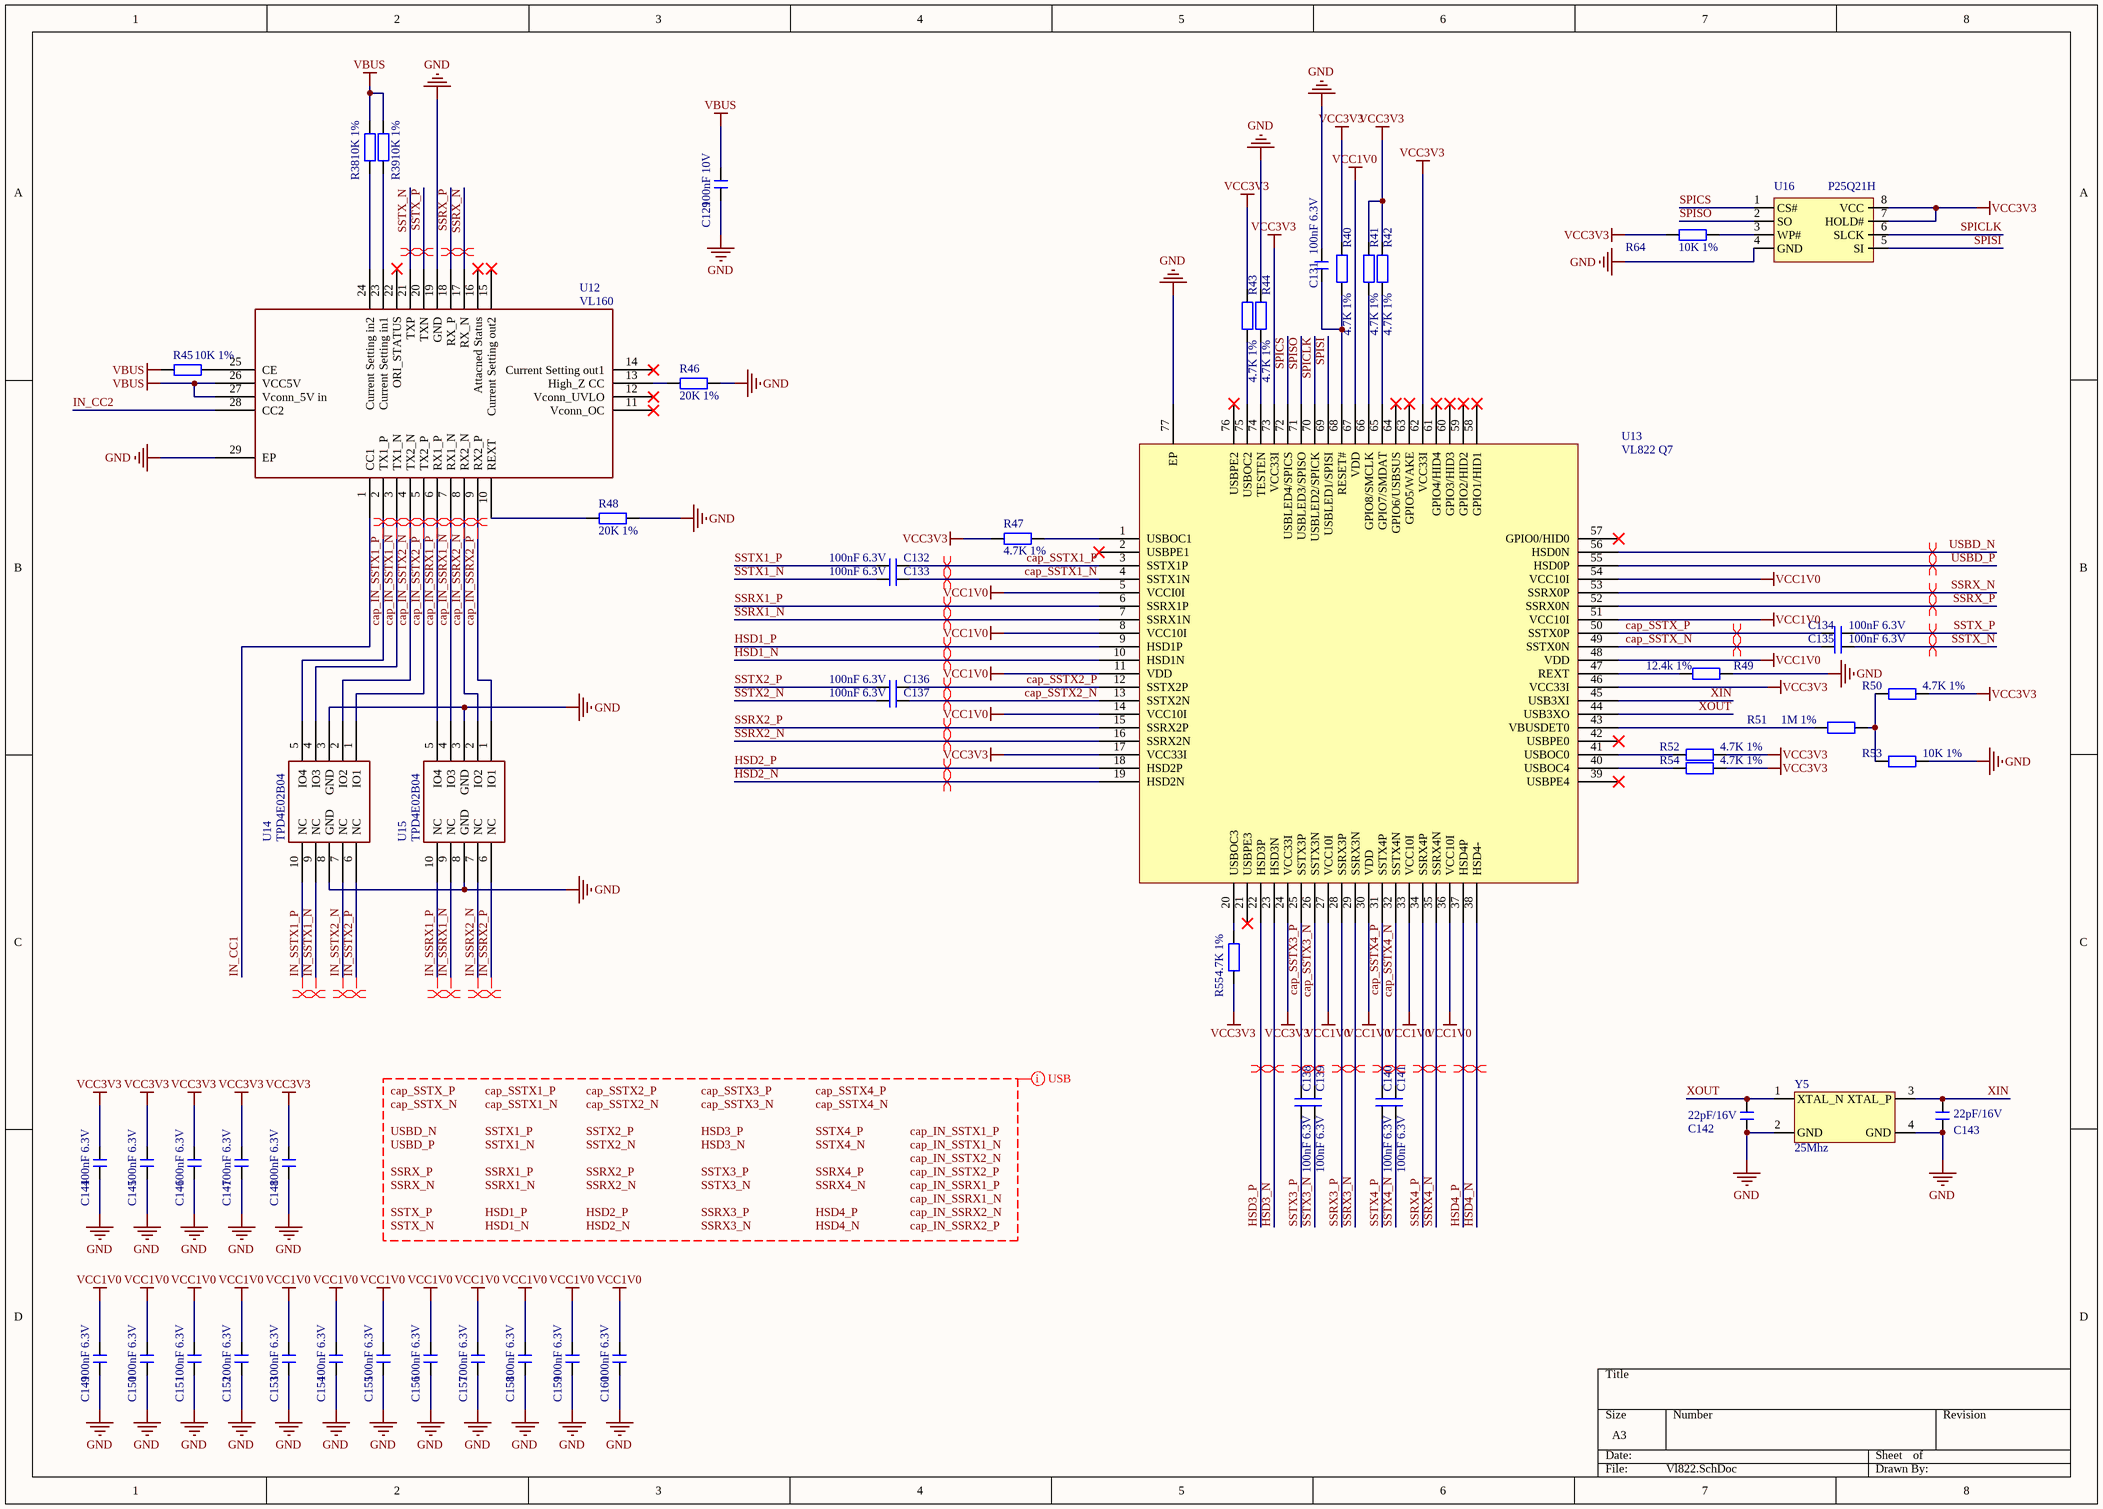
[diagram p4: Vl822.SchDoc]

### Parts
C129  100nF 10V  [C0402_L]
C131  100nF 6.3V  [C0402_L]
C132  100nF 6.3V  [C0402_L]
C133  100nF 6.3V  [C0402_L]
C134  100nF 6.3V  [C0402_L]
C135  100nF 6.3V  [C0402_L]
C136  100nF 6.3V  [C0402_L]
C137  100nF 6.3V  [C0402_L]
C138  100nF 6.3V  [C0402_L]
C139  100nF 6.3V  [C0402_L]
C140  100nF 6.3V  [C0402_L]
C141  100nF 6.3V  [C0402_L]
C142  22pF/16V  [C0402_L]
C143  22pF/16V  [C0402_L]
C144  100nF 6.3V  [C0402_L]
C145  100nF 6.3V  [C0402_L]
C146  100nF 6.3V  [C0402_L]
C147  100nF 6.3V  [C0402_L]
C148  100nF 6.3V  [C0402_L]
C149  100nF 6.3V  [C0402_L]
C150  100nF 6.3V  [C0402_L]
C151  100nF 6.3V  [C0402_L]
C152  100nF 6.3V  [C0402_L]
C153  100nF 6.3V  [C0402_L]
C154  100nF 6.3V  [C0402_L]
C155  100nF 6.3V  [C0402_L]
C156  100nF 6.3V  [C0402_L]
C157  100nF 6.3V  [C0402_L]
C158  100nF 6.3V  [C0402_L]
C159  100nF 6.3V  [C0402_L]
C160  100nF 6.3V  [C0402_L]
R38  10K 1%  [R0402_L]
R39  10K 1%  [R0402_L]
R40  4.7K 1%  [R0402_L]
R41  4.7K 1%  [R0402_L]
R42  4.7K 1%  [R0402_L]
R43  4.7K 1%  [R0402_L]
R44  4.7K 1%  [R0402_L]
R45  10K 1%  [R0402_L]
R46  20K 1%  [R0402_L]
R47  4.7K 1%  [R0402_L]
R48  20K 1%  [R0402_L]
R49  12.4k 1%  [R0402_L]
R50  4.7K 1%  [R0402_L]
R51  1M 1%  [R0402_L]
R52  4.7K 1%  [R0402_L]
R53  10K 1%  [R0402_L]
R54  4.7K 1%  [R0402_L]
R55  4.7K 1%  [R0402_L]
R64  10K 1%  [R0402_L]
U12  VL160  [MQFN-28_L4.5-W3.5-P0.40-BL-EP]
U13  VL822 Q7  [QFN-76_L9.0-W9.0-P0.40-EP6.3-TL]
U14  TPD4E02B04  [DIO_TPD4E02B04DQAR]
U15  TPD4E02B04  [DIO_TPD4E02B04DQAR]
U16  P25Q21H  [SOP8_L]
Y5  25Mhz  [OSC 3225-4P]

### Nets
GND: C129.1 C131.2 C142.2 C143.2 C144.1 C145.1 C146.1 C147.1 C148.1 C149.1 C150.1 C151.1 C152.1 C153.1 C154.1 C155.1 C156.1 C157.1 C158.1 C159.1 C160.1 R44.2 R46.1 R48.1 R49.2 R53.2 U12.19(GND) U12.29(EP) U13.77(EP) U14.3(GND) U14.8(GND) U15.3(GND) U15.8(GND) U16.4(GND) Y5.2(GND) Y5.4(GND)
VBUS: C129.2 R38.1 R39.1 R45.2 U12.26(VCC5V) U12.27(Vconn_5V_in)
VCC1V0: C149.2 C150.2 C151.2 C152.2 C153.2 C154.2 C155.2 C156.2 C157.2 C158.2 C159.2 C160.2 U13.5(VCCI0I) U13.8(VCC10I) U13.11(VDD) U13.14(VCC10I) U13.27(VCC10I) U13.30(VDD) U13.33(VCC10I) U13.36(VCC10I) U13.48(VDD) U13.51(VCC10I) U13.54(VCC10I) U13.67(VDD)
VCC3V3: C144.2 C145.2 C146.2 C147.2 C148.2 R40.2 R41.2 R42.2 R43.2 R47.2 R50.2 R52.2 R54.2 R55.2 R64.2 U13.17(VCC33I) U13.24(VCC33I) U13.46(VCC33I) U13.62(VCC33I) U13.73(VCC33I) U16.7(HOLD#) U16.8(VCC)
cap_IN_SSRX1_N: U12.7(RX1_N) U15.4(IO3)
cap_IN_SSRX1_P: U12.6(RX1_P) U15.5(IO4)
cap_IN_SSRX2_N: U12.8(RX2_N) U15.2(IO2)
cap_IN_SSRX2_P: U12.9(RX2_P) U15.1(IO1)
cap_IN_SSTX1_N: U12.3(TX1_N) U14.4(IO3)
cap_IN_SSTX1_P: U12.2(TX1_P) U14.5(IO4)
cap_IN_SSTX2_N: U12.4(TX2_N) U14.2(IO2)
cap_IN_SSTX2_P: U12.5(TX2_P) U14.1(IO1)
cap_SSTX1_N: C133.2 U13.4(SSTX1N)
cap_SSTX1_P: C132.2 U13.3(SSTX1P)
cap_SSTX2_N: C137.2 U13.13(SSTX2N)
cap_SSTX2_P: C136.2 U13.12(SSTX2P)
cap_SSTX3_N: C139.2 U13.26(SSTX3N)
cap_SSTX3_P: C138.2 U13.25(SSTX3P)
cap_SSTX4_N: C141.2 U13.32(SSTX4N)
cap_SSTX4_P: C140.2 U13.31(SSTX4P)
cap_SSTX_N: C135.2 U13.49(SSTX0N)
cap_SSTX_P: C134.2 U13.50(SSTX0P)
HSD1_N: U13.10(HSD1N)
HSD1_P: U13.9(HSD1P)
HSD2_N: U13.19(HSD2N)
HSD2_P: U13.18(HSD2P)
HSD3_N: U13.23(HSD3N)
HSD3_P: U13.22(HSD3P)
HSD4_N: U13.38(HSD4-)
HSD4_P: U13.37(HSD4P)
IN_CC1: U12.1(CC1)
IN_CC2: U12.28(CC2)
IN_SSRX1_N: U15.9(NC)
IN_SSRX1_P: U15.10(NC)
IN_SSRX2_N: U15.7(NC)
IN_SSRX2_P: U15.6(NC)
IN_SSTX1_N: U14.9(NC)
IN_SSTX1_P: U14.10(NC)
IN_SSTX2_N: U14.7(NC)
IN_SSTX2_P: U14.6(NC)
SPICLK: U13.70(USBLED2/SPICK) U16.6(SLCK)
SPICS: U13.72(USBLED4/SPICS) U16.1(CS#)
SPISI: U13.69(USBLED1/SPISI) U16.5(SI)
SPISO: U13.71(USBLED3/SPISO) U16.2(SO)
SSRX1_N: U13.7(SSRX1N)
SSRX1_P: U13.6(SSRX1P)
SSRX2_N: U13.16(SSRX2N)
SSRX2_P: U13.15(SSRX2P)
SSRX3_N: U13.29(SSRX3N)
SSRX3_P: U13.28(SSRX3P)
SSRX4_N: U13.35(SSRX4N)
SSRX4_P: U13.34(SSRX4P)
SSRX_N: U12.17(RX_N) U13.53(SSRX0P)
SSRX_P: U12.18(RX_P) U13.52(SSRX0N)
SSTX1_N: C133.1
SSTX1_P: C132.1
SSTX2_N: C137.1
SSTX2_P: C136.1
SSTX3_N: C139.1
SSTX3_P: C138.1
SSTX4_N: C141.1
SSTX4_P: C140.1
SSTX_N: C135.1 U12.21(TXP)
SSTX_P: C134.1 U12.20(TXN)
USBD_N: U13.56(HSD0N)
USBD_P: U13.55(HSD0P)
XIN: C143.1 U13.45(USB3XI) Y5.3(XTAL_P)
XOUT: C142.1 U13.44(USB3XO) Y5.1(XTAL_N)
NetC131_1: C131.1 R40.1 U13.68(RESET#)
NetR38_2: R38.2 U12.24(Current_Setting_in2)
NetR39_2: R39.2 U12.23(Current_Setting_in1)
NetR41_1: R41.1 U13.66(GPIO8/SMCLK)
NetR42_1: R42.1 U13.65(GPIO7/SMDAT)
NetR43_1: R43.1 U13.75(USBOC2)
NetR44_1: R44.1 U13.74(TESTEN)
NetR45_1: R45.1 U12.25(CE)
NetR46_2: R46.2 U12.13(High_Z_CC)
NetR47_1: R47.1 U13.1(USBOC1)
NetR48_2: R48.2 U12.10(REXT)
NetR49_1: R49.1 U13.47(REXT)
NetR50_1: R50.1 R51.2 R53.1
NetR51_1: R51.1 U13.43(VBUSDET0)
NetR52_1: R52.1 U13.41(USBOC0)
NetR54_1: R54.1 U13.40(USBOC4)
NetR55_1: R55.1 U13.20(USBOC3)
NetR64_1: R64.1 U16.3(WP#)

Not connected (* = marked no-connect by the designer): U12 11(Vconn_OC)* 12(Vconn_UVLO)* 14(Current_Setting_out1)* 15(Current_Setting_out2)* 16(Attacned_Status)* 22(ORI_STATUS)*; U13 2(USBPE1)* 21(USBPE3)* 39(USBPE4)* 42(USBPE0)* 57(GPIO0/HID0)* 58(GPIO1/HID1)* 59(GPIO2/HID2)* 60(GPIO3/HID3)* 61(GPIO4/HID4)* 63(GPIO5/WAKE)* 64(GPIO6/USBSUS)* 76(USBPE2)*

### Layout directives
differential pair: cap_IN_SSRX1_N, cap_IN_SSRX1_P, cap_IN_SSRX2_N, cap_IN_SSRX2_P, cap_IN_SSTX1_N, cap_IN_SSTX1_P, cap_IN_SSTX2_N, cap_IN_SSTX2_P, cap_SSTX1_N, cap_SSTX1_P, cap_SSTX2_N, cap_SSTX2_P, cap_SSTX3_N, cap_SSTX3_P, cap_SSTX4_N, cap_SSTX4_P, cap_SSTX_N, cap_SSTX_P, HSD1_N, HSD1_P, HSD2_N, HSD2_P, HSD3_N, HSD3_P, HSD4_N, HSD4_P, IN_SSRX1_N, IN_SSRX1_P, IN_SSRX2_N, IN_SSRX2_P, IN_SSTX1_N, IN_SSTX1_P, IN_SSTX2_N, IN_SSTX2_P, SSRX1_N, SSRX1_P, SSRX2_N, SSRX2_P, SSRX3_N, SSRX3_P, SSRX4_N, SSRX4_P, SSRX_N, SSRX_P, SSTX_N, SSTX_P, USBD_N, USBD_P
net class USB; rule Differential Pairs Routing [Pref Gap = 4mil    Min Gap  = 4mil    Max Gap  = 4milPref Width = 5.15mil    Min Width  = 5.15mil    Max Width  = 5.15mil]: cap_IN_SSRX1_N, cap_IN_SSRX1_P, cap_IN_SSRX2_N, cap_IN_SSRX2_P, cap_IN_SSTX1_N, cap_IN_SSTX1_P, cap_IN_SSTX2_N, cap_IN_SSTX2_P, cap_SSTX1_N, cap_SSTX1_P, cap_SSTX2_N, cap_SSTX2_P, cap_SSTX3_N, cap_SSTX3_P, cap_SSTX4_N, cap_SSTX4_P, cap_SSTX_N, cap_SSTX_P, HSD1_N, HSD1_P, HSD2_N, HSD2_P, HSD3_N, HSD3_P, HSD4_N, HSD4_P, SSRX1_N, SSRX1_P, SSRX2_N, SSRX2_P, SSRX3_N, SSRX3_P, SSRX4_N, SSRX4_P, SSRX_N, SSRX_P, SSTX1_N, SSTX1_P, SSTX2_N, SSTX2_P, SSTX3_N, SSTX3_P, SSTX4_N, SSTX4_P, SSTX_N, SSTX_P, USBD_N, USBD_P

### Notes on the sheet
- Labels drawn without touching a wire or pin: cap_IN_SSRX1_N, cap_IN_SSRX1_P, cap_IN_SSRX2_N, cap_IN_SSRX2_P, cap_IN_SSTX1_N, cap_IN_SSTX1_P, cap_IN_SSTX2_N, cap_IN_SSTX2_P, cap_SSTX1_N, cap_SSTX1_P, cap_SSTX2_N, cap_SSTX2_P, cap_SSTX3_N, cap_SSTX3_P, cap_SSTX4_N, cap_SSTX4_P, cap_SSTX_N, cap_SSTX_P, HSD1_N, HSD1_P, HSD2_N, HSD2_P, HSD3_N, HSD3_P, HSD4_N, HSD4_P, SSRX1_N, SSRX1_P, SSRX2_N, SSRX2_P, SSRX3_N, SSRX3_P, SSRX4_N, SSRX4_P, SSRX_N, SSRX_P, SSTX1_N, SSTX1_P, SSTX2_N, SSTX2_P, SSTX3_N, SSTX3_P, SSTX4_N, SSTX4_P, SSTX_N, SSTX_P, USBD_N, USBD_P

### Library data of the parts
C129 C131-C160 = C: 无极性贴片电容; 版权归属: 源创客; 材质: X7R; BOM名称: 无极性贴片电容; 学习资源: www.ooocke.com
R38-R55 R64 = R: 贴片电阻; 版权归属: 源创客; BOM名称: 贴片电阻; 学习资源: www.ooocke.com
U14 U15 = TPD4E02B04: ESD
U16 = P25D40H
Y5 = Crystal

## Nets that join several sheets
GND: Connector (38 pins), jms578 (112 pins), Pwr (59 pins), Vl822 (36 pins)
VBUS: Connector (J3.A4 J3.A9 J3.B4 J3.B9), jms578 (16 pins), Pwr (5 pins), Vl822 (6 pins)
VCC1V0: Pwr (C125.2 C126.2 L7.1 R34.1), Vl822 (24 pins)
VCC3V3: Connector (8 pins), Pwr (C127.2 C128.2 L8.1 R35.1), Vl822 (22 pins)
VCC5V-A: Connector (6 pins), Pwr (10 pins)
VCC5V-B: Connector (6 pins), Pwr (8 pins)
VCC12V: Connector (12 pins), Pwr (20 pins)
VIN: Connector (CON1.1), Pwr (C130.1 Q1.2 R18.1)
HSD1_N: jms578 (U6.13), Vl822 (U13.10)
HSD1_P: jms578 (U6.15), Vl822 (U13.9)
HSD2_N: jms578 (U5.13), Vl822 (U13.19)
HSD2_P: jms578 (U5.15), Vl822 (U13.18)
HSD3_N: jms578 (U2.13), Vl822 (U13.23)
HSD3_P: jms578 (U2.15), Vl822 (U13.22)
HSD4_N: jms578 (U1.13), Vl822 (U13.38)
HSD4_P: jms578 (U1.15), Vl822 (U13.37)
IN_CC1: Connector (J3.A5), Vl822 (U12.1)
IN_CC2: Connector (J3.B5), Vl822 (U12.28)
IN_SSRX1_N: Connector (J3.B11), Vl822 (U15.9)
IN_SSRX1_P: Connector (J3.B10), Vl822 (U15.10)
IN_SSRX2_N: Connector (J3.A10), Vl822 (U15.7)
IN_SSRX2_P: Connector (J3.A11), Vl822 (U15.6)
IN_SSTX1_N: Connector (J3.A3), Vl822 (U14.9)
IN_SSTX1_P: Connector (J3.A2), Vl822 (U14.10)
IN_SSTX2_N: Connector (J3.B2), Vl822 (U14.7)
IN_SSTX2_P: Connector (J3.B3), Vl822 (U14.6)
RX1_N: Connector (C5.2), jms578 (U6.31)
RX1_P: Connector (C7.2), jms578 (U6.30)
RX2_N: Connector (C6.2), jms578 (U5.31)
RX2_P: Connector (C8.2), jms578 (U5.30)
RX3_N: Connector (C13.2), jms578 (U2.31)
RX3_P: Connector (C15.2), jms578 (U2.30)
RX4_N: Connector (C14.2), jms578 (U1.31)
RX4_P: Connector (C16.2), jms578 (U1.30)
SSRX1_N: jms578 (C94.1), Vl822 (U13.7)
SSRX1_P: jms578 (C96.1), Vl822 (U13.6)
SSRX2_N: jms578 (C93.1), Vl822 (U13.16)
SSRX2_P: jms578 (C95.1), Vl822 (U13.15)
SSRX3_N: jms578 (C52.1), Vl822 (U13.29)
SSRX3_P: jms578 (C54.1), Vl822 (U13.28)
SSRX4_N: jms578 (C51.1), Vl822 (U13.35)
SSRX4_P: jms578 (C53.1), Vl822 (U13.34)
SSTX1_N: jms578 (U6.22), Vl822 (C133.1)
SSTX1_P: jms578 (U6.23), Vl822 (C132.1)
SSTX2_N: jms578 (U5.22), Vl822 (C137.1)
SSTX2_P: jms578 (U5.23), Vl822 (C136.1)
SSTX3_N: jms578 (U2.22), Vl822 (C139.1)
SSTX3_P: jms578 (U2.23), Vl822 (C138.1)
SSTX4_N: jms578 (U1.22), Vl822 (C141.1)
SSTX4_P: jms578 (U1.23), Vl822 (C140.1)
TX1_N: Connector (C3.2), jms578 (U6.33)
TX1_P: Connector (C1.2), jms578 (U6.34)
TX2_N: Connector (C4.2), jms578 (U5.33)
TX2_P: Connector (C2.2), jms578 (U5.34)
TX3_N: Connector (C11.2), jms578 (U2.33)
TX3_P: Connector (C9.2), jms578 (U2.34)
TX4_N: Connector (C12.2), jms578 (U1.33)
TX4_P: Connector (C10.2), jms578 (U1.34)
USBD_N: Connector (J3.A7 J3.B7), Vl822 (U13.56)
USBD_P: Connector (J3.A6 J3.B6), Vl822 (U13.55)